# Altium schematic sheet 01_Arduino_IO.SchDoc
size A; SheetNumber: 2; SheetTotal: 5; SPICEModelCacheVHLISZVB: <root> / <DocumentId>VHLISZVB</DocumentId> / </root>
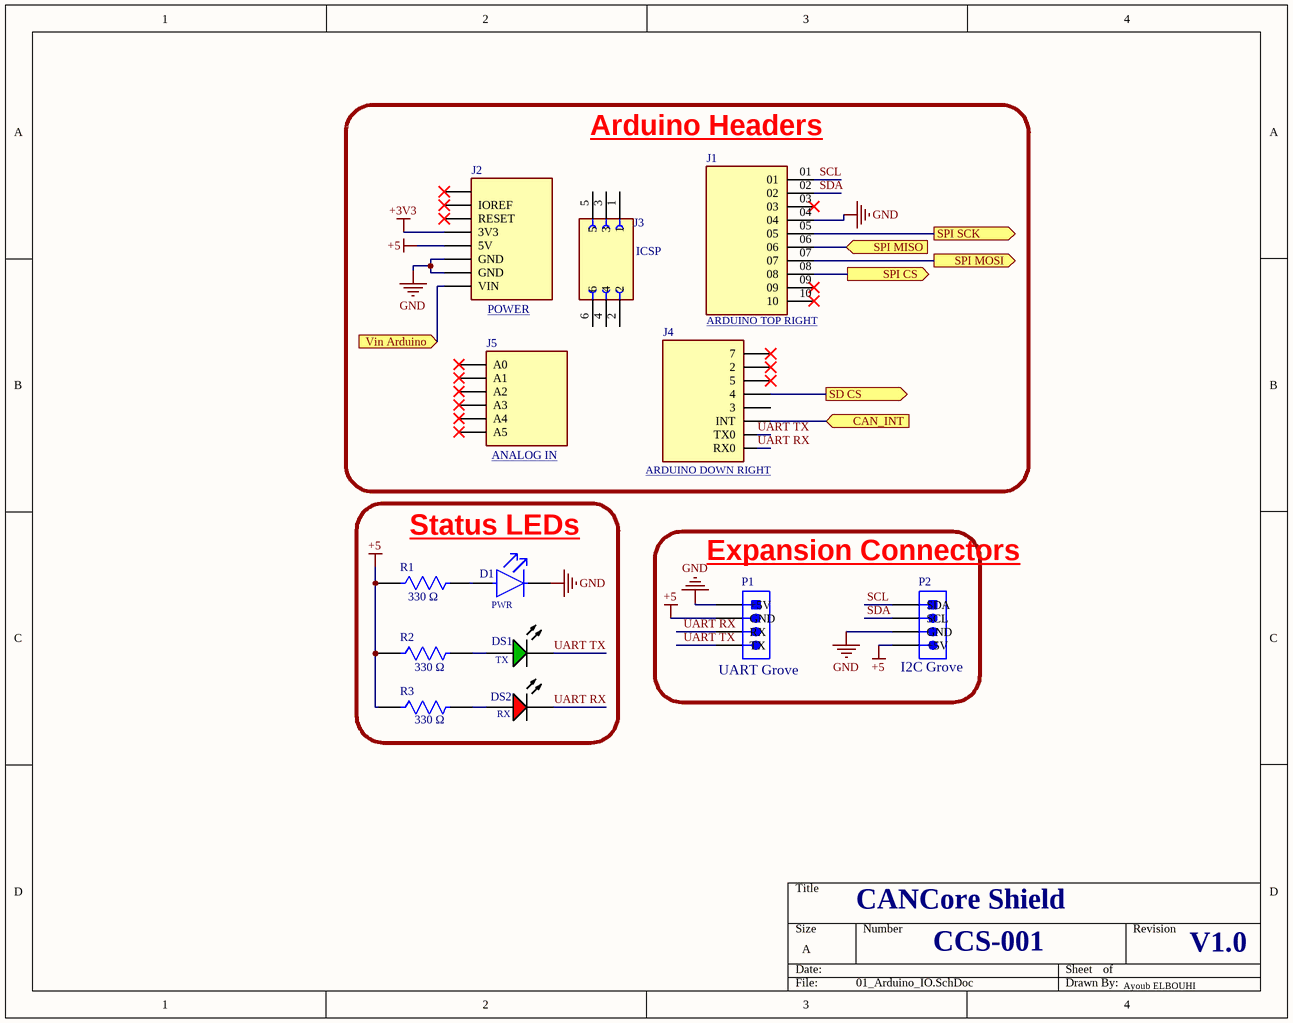
[diagram p0: 01_Arduino_IO.SchDoc]

## Parts
D1  PWR  [FP-LTST-C170KFKT-MFG]
DS1  TX  [LTST-LTST-C170KGKT-2_V]
DS2  RX  [LTST-C170KRKT_V]
J1  ARDUINO TOP RIGHT  [SAMTEC_ESQ-110-14-G-S]
J2  POWER  [SAMTEC_ESQ-108-14-G-S]
J3  ICSP  [SULLINS_PPTC032LFBN-RC]
J4  ARDUINO DOWN RIGHT  [SAMTEC_ESQ-108-14-G-S]
J5  ANALOG IN  [SAMTEC_ESQ-106-14-G-S]
P1  UART Grove  [JST-B4B-PH-K-S_V]
P2  I2C Grove  [JST-B4B-PH-K-S_V]
R1  330 Ω  [FP-RT0603-MFG]
R2  330 Ω  [FP-RT0603-MFG]
R3  330 Ω  [FP-RT0603-MFG]

## Blocks framed on the sheet
Arduino Headers: J1-J5
Status LEDs: D1 DS1 DS2 R1-R3
Expansion Connectors: P1 P2

## Ports
CAN_INT (in), SD CS (out), SPI CS (out), SPI MISO (in), SPI MOSI (out), SPI SCK (out), Vin Arduino (in)

## Nets
+3V3: J2.04(3V3)
+5: J2.05(5V) P1.2(GND) P2.4(+5V) R1.1 R2.1 R3.1
GND: D1.1(C) J1.04 J2.06(GND) J2.07(GND) P1.1(+5V) P2.3(GND)
CAN_INT: J4.06(INT) ; port CAN_INT
SCL: J1.01 P2.1(SDA)
SD CS: J4.04(4) ; port SD CS
SDA: J1.02 P2.2(SCL)
SPI CS: J1.08 ; port SPI CS
SPI MISO: J1.06 ; port SPI MISO
SPI MOSI: J1.07 ; port SPI MOSI
SPI SCK: J1.05 ; port SPI SCK
UART RX: DS2.2(K) J4.08(RX0) P1.3(RX)
UART TX: DS1.1(K) J4.07(TX0) P1.4(TX)
Vin Arduino: J2.08(VIN) ; port Vin Arduino
NetD1_2: D1.2(A) R1.2
NetDS1_2: DS1.2(A) R2.2
NetDS2_1: DS2.1(A) R3.2

Not connected (* = marked no-connect by the designer): J1 03* 09* 10*; J2 01* 02(IOREF)* 03(RESET)*; J3 1 2 3 4 5 6; J4 01(7)* 02(2)* 03(5)* 05(3); J5 01(A0)* 02(A1)* 03(A2)* 04(A3)* 05(A4)* 06(A5)*

## Notes on the sheet
- CANCore Shield
- CCS-001
- V1.0
- Ayoub ELBOUHI

## Library data of the parts
D1 = CMP-22017-000036-1: LED ORANGE CLEAR SMD; Forward Current: 30mA; Reverse Voltage: 5V; Forward Voltage: 2V; Lens Style: Diffused; Number of Elements: 1; Test Current: 20mA; Lens Color: Colorless; Viewing Angle: 130°; Dominant Wavelength: 605nm; Luminous Intensity: 60mcd; Power Rating: 75mW; Wavelength: 611nm; Min Operating Temperature: -55°C; Packaging: Tape and Reel; Case Code (Metric): 2012; Depth: 1.6mm; Case Code (Imperial): 0805; Mount: Surface Mount; Radiation Hardening: No; Lens Transparency: Clear; Color: Orange; Package Quantity: 1; Illumination Color: Orange; Lead Free: Lead Free; Number of LEDs: 1; Length: 3.2mm; Height: 1.1mm; Number of Pins: 2; Width: 1.25mm; Case/Package: 0805; Power Dissipation: 75mW; Max Operating Temperature: 85°C
DS1 = CMP-2000-06620-1: Ultra Bright AlInGaP Chip LED, 75 mW, -55 to 85 degC, 2-Pin SMD (0805), RoHS, Tape and Reel; Manufacturer: Lite-On; Forward Current: 30mA; Power Dissipation Max: 75mW; Emitting Color: YellowGreen; Type: Uni-Color; Forward Voltage: 2.4V; Dominant Wave Length: 571nm; Test Current (It): 20mA; Product Length (mm): 2mm; Peak Wavelength: 574nm; Power Dissipation: 75W; Product Depth (mm): 1.25mm; DELETED: Compliant; High Brightness: Yes; Product Height (mm): 1.1mm; Luminous Intensity: 35mcd; Shape Type: Rectangular; Chip Material: AlGaInP; Viewing Angle: 130deg; Number of  Elements: 1; Reverse Voltage: 5V; Rad Hardened: No; Package Type: ChipLed; Manufacturer URL: http://www.us.liteon.com/; Mounting: SurfaceMount; Operating Temp Range: -55Cto85C; Datasheet URL: http://optoelectronics.liteon.com/upload/download/DS22-2000-073/S_110_LTST-C170KGKT.pdf; Packaging: TapeandReel; Pin Count: 2; Package Description: 2-Pin Surface Mounted Device, Body 2 x 1.25 mm; Mounting Technology: SurfaceMount; Package Reference: LTST-C170KGKT-2; Forward Current Max: 30mA; Datasheet Version: Rev. G, 06/2005; Lens Dimensions: 1.4x1.25x0.6mm; Operating Temperature Classification: Industrial; Lum Intensity: 35mcd; Main Category: ChipLED
DS2 = CMP-2000-07593-1: LED Red, 75 mW, 54 mcd, -55 to 85 degC, 2-Pin SMD, RoHS, Tape and Reel; Manufacturer: Lite-On; Lens Transparency: Clear; Number of Elements: 1; Power Rating: 75mW; Luminous Intensity: 54mcd; Viewing Angle: 130degrees; Forward Current: 30mA; Wavelength: 639nm; Lens Style: Rectangular; Case\/Package: 0805; Test Current: 20mA; Dominant Wavelength: 631nm; Forward Voltage: 2V; Lens Colour: Colorless; Min Operating Temperature: -55degC; RoHSCompliant: True; Length: 3.2mm; Width: 1.25mm; Mount: SurfaceMount; Packaging: TapeandReel; Number of LEDs: 1; Radiation Hardening: No; Datasheet URL: http://optoelectronics.liteon.com/upload/download/DS-22-99-0150/LTST-C170KRKT.pdf; Datasheet Version: Rev. D, 11/2014; Case Code (Metric): 2012; Height: 1.1mm; Number of Pins: 2; Package Description: 2-Pin Surface Mount Device, Body 2 x 1.25 mm; Manufacturer URL: http://www.us.liteon.com/; Lead Free: LeadFree; Illumination Colour: Red; Colour: Red; Case Code (Imperial): 0805; Max Operating Temperature: 85degC; Power Dissipation: 75mW; Mounting Technology: SurfaceMount; Package Reference: C170KRKT; Package Quantity: 1; Depth: 1.6mm
J1 = ESQ-110-14-G-S: MF: Samtec; Package: None; MP: ESQ-110-14-G-S; Value: *; Price: None; Availability: Unavailable
J2 J4 = ESQ-108-14-G-S: MP: ESQ-108-14-G-S; Value: *; Package: None; Price: None; Availability: Unavailable
J3 = PPTC032LFBN-RC: 6 Position Header Connector 0.100 (2.54mm) Through Hole Tin; MF: Sullins Connector Solutions; Package: None; Price: None; Value: *; SnapEDA_Link: https://www.snapeda.com/parts/PPTC032LFBN-RC/Sullins+Connector+Solutions/view-part/?ref=snap; MP: PPTC032LFBN-RC; Availability: Not in stock; Check_prices: https://www.snapeda.com/parts/PPTC032LFBN-RC/Sullins+Connector+Solutions/view-part/?ref=eda
J5 = ESQ-106-14-G-S: MP: ESQ-106-14-G-S; Price: None; Package: None; Availability: Unavailable; Value: *
P1 P2 = CMP-2000-05165-1: Male Header, Pitch 2 mm, 1 x 4 Position, Height 6 mm, Tail Length 3.4 mm, -25 to 85 degC, RoHS, Bulk; Manufacturer: JST; No of Positions: 4; Style/Orientation: StraightHeader/Plug; Pitch: 2mm; Datasheet URL: http://datasheet.octopart.com/B4B-PH-K-S%28LF%29%28SN%29-JST-datasheet-10558886.pdf; Type: ShroudedHeader; Manufacturer URL: http://www.jst.com/home2.html; Termination: Crimp; Datasheet Version: Apr-09
R1-R3 = CMP-03412-025644-1: RES SMD 330 OHM 1% 1/10W 0603; Manufacturer: Yageo; Manufacturer Part Number: RT0603FRD07330RL; Resistance: 330Ω; Tolerance: 0.01; Power Rating: 0.1W; Temperature Coefficient: 25 ppm/°C; Voltage Rating: 75V; Value: 330Ω; Octopart: https://octopart.com/rt0603frd07330rl-yageo-71395358; Temperature: -55°C to +155°C; Height: 0.55mm; Temperature Range Low: -55°C; Category: Res; Ipc Land Pattern Name: RESC16080X45; Device Class L1: Passive Components; ComponentLink2Description: Datasheet; Temperature Range High: +155°C; RoHS: TRUE; Footprint Url: http://www.yageo.com/exep/pages/download/literatures/PYu-R_Mount_10.pdf; ComponentLink2URL: http://www.yageo.com/documents/recent/PYu-RT_1-to-0.01_RoHS_L_9.pdf; Automotive: No; Device Class L3: Chip SMD Resistors; Series: RT; Composition: Thin Film; Device Class L2: Resistors; Digikey Description: RES SMD 330 OHM 1% 1/10W 0603; Package: RT0603; Lead Free: Yes